# Altium schematic sheet MotorsController.SchDoc
size A3; SheetNumber: 4; SheetTotal: 6
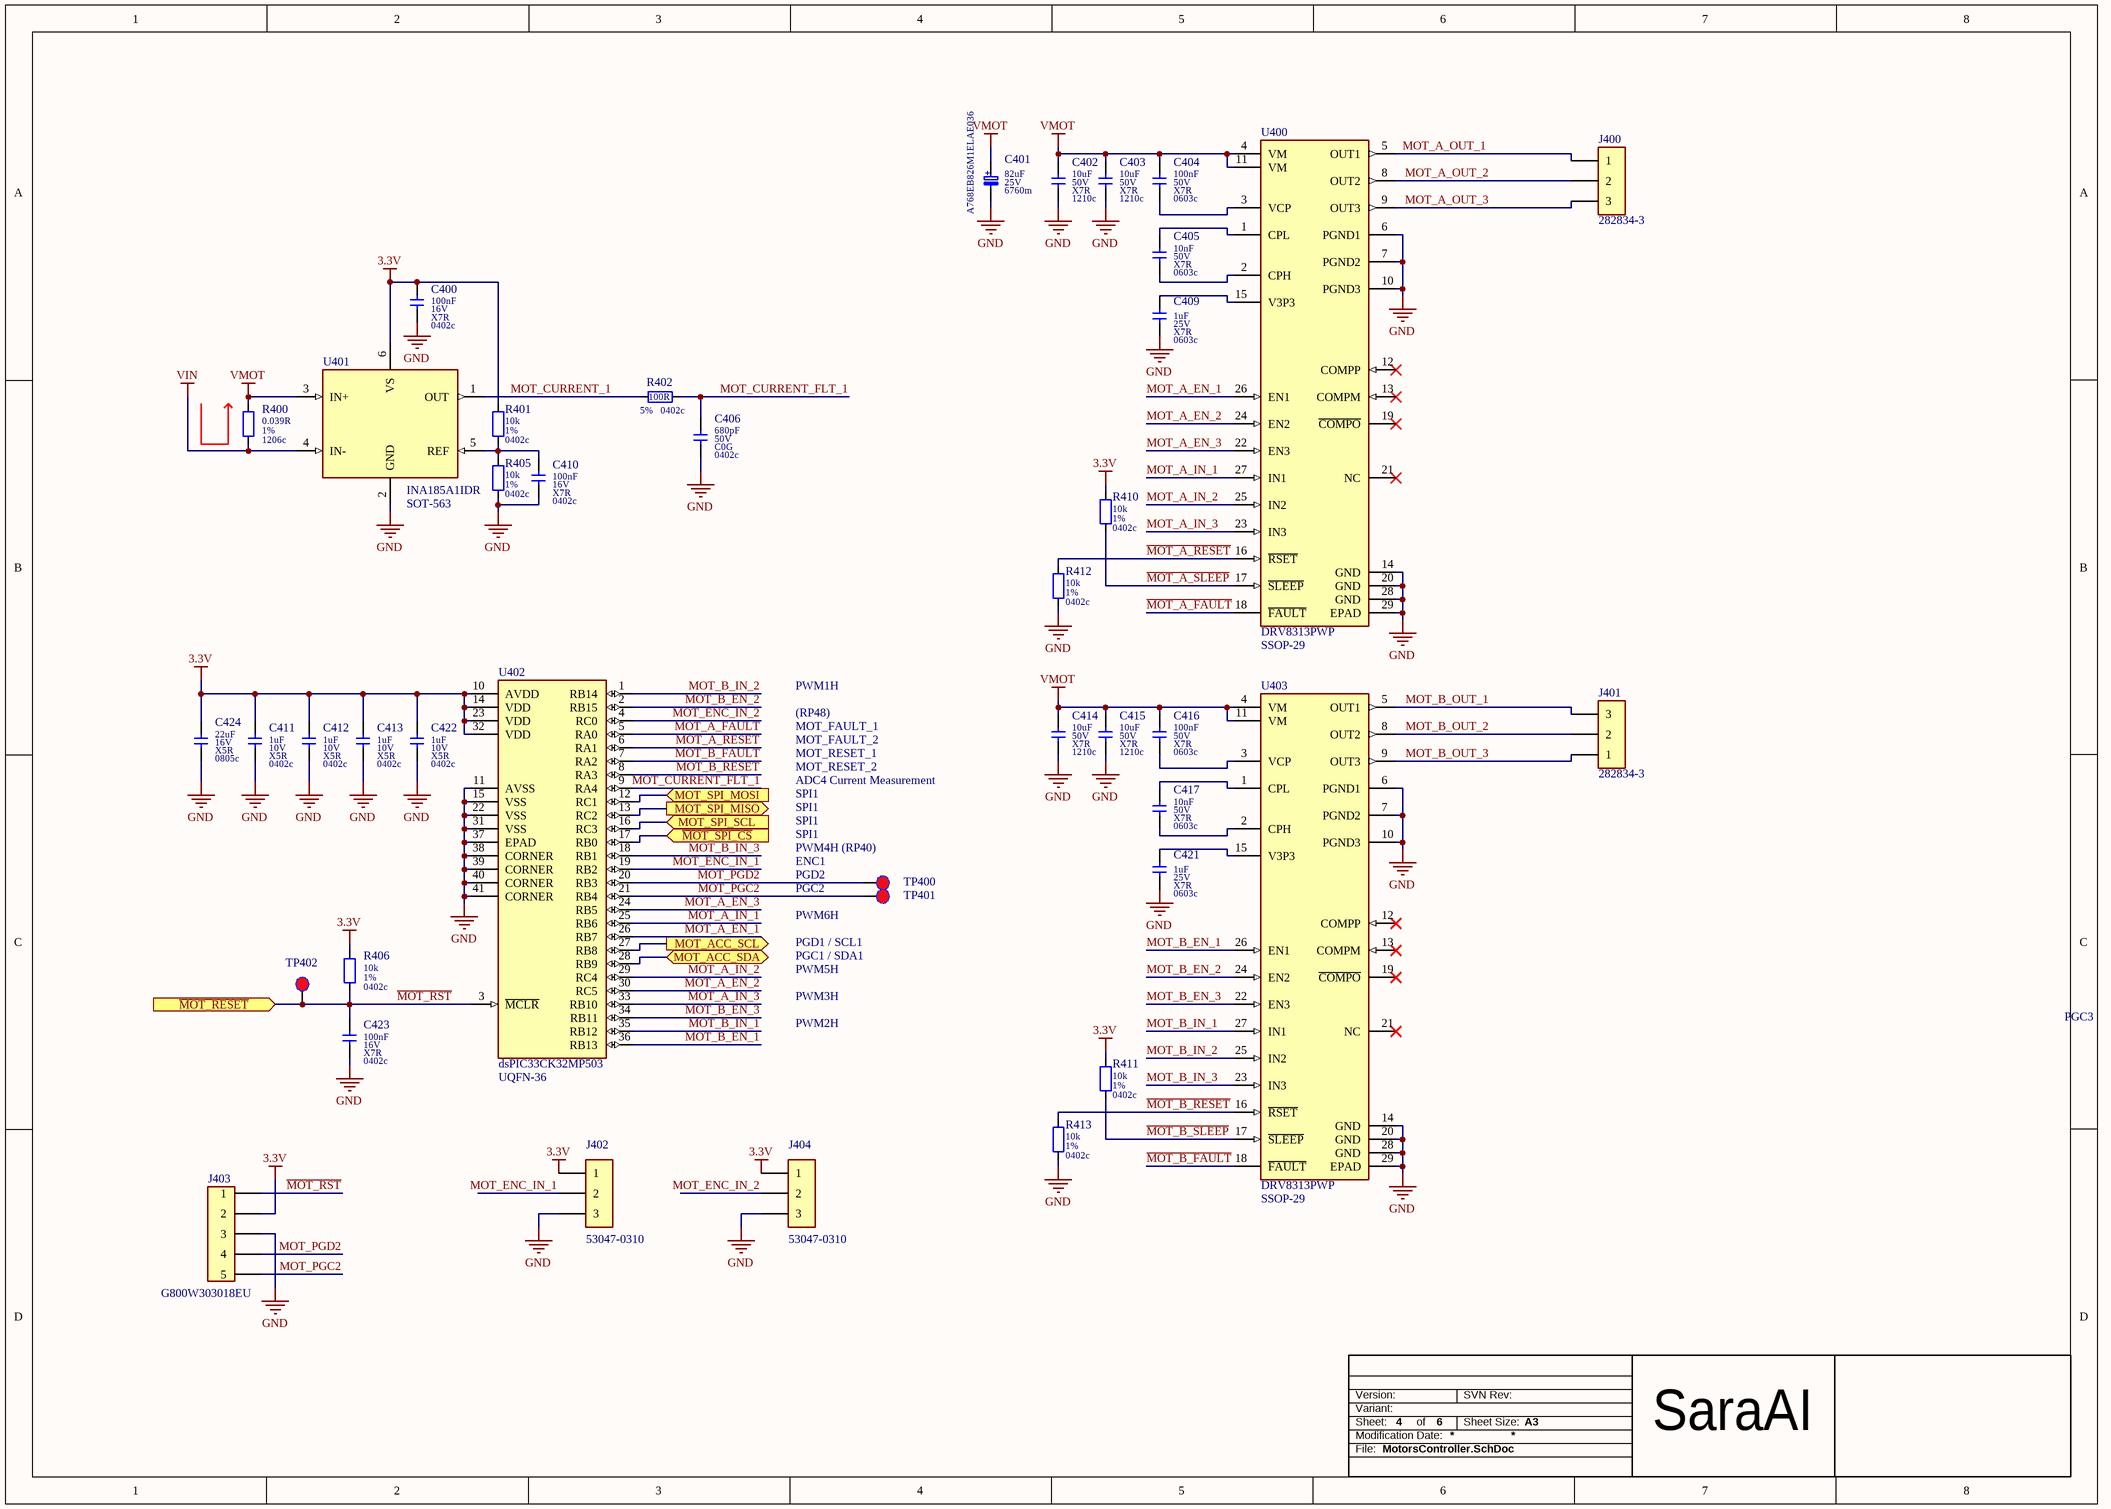
[diagram p0: MotorsController.SchDoc]

## Parts
C400  11 Parameter 4: X7R  07 Package: 0402c  08 Parameter 1: 100nF  09 Parameter 2: 16V  [CAPC1005X60L]  (hidden comment: CL05B104KO5NNNC)
C401  09 Parameter 2: 25V  08 Parameter 1: 82uF  07 Package: 6760m  [CAPAE660X60L]  (hidden comment: A768EB826M1ELAE036)
C402  11 Parameter 4: X7R  07 Package: 1210c  08 Parameter 1: 10uF  09 Parameter 2: 50V  [CAPC3225X270L]  (hidden comment: CL32B106KBJNNNE)
C403  11 Parameter 4: X7R  07 Package: 1210c  08 Parameter 1: 10uF  09 Parameter 2: 50V  [CAPC3225X270L]  (hidden comment: CL32B106KBJNNNE)
C404  11 Parameter 4: X7R  07 Package: 0603c  08 Parameter 1: 100nF  09 Parameter 2: 50V  [CAPC1608X90L]  (hidden comment: CL10B104KB8NNNC)
C405  11 Parameter 4: X7R  07 Package: 0603c  08 Parameter 1: 10nF  09 Parameter 2: 50V  [CAPC1608X90L]  (hidden comment: CL10B103KB8NNNC)
C406  11 Parameter 4: C0G  07 Package: 0402c  08 Parameter 1: 680pF  09 Parameter 2: 50V  [CAPC1005X60L]  (hidden comment: C0402C681J5GAC)
C409  11 Parameter 4: X7R  07 Package: 0603c  08 Parameter 1: 1uF  09 Parameter 2: 25V  [CAPC1608X90L]  (hidden comment: CL10B105KA8NNNC)
C410  11 Parameter 4: X7R  07 Package: 0402c  08 Parameter 1: 100nF  09 Parameter 2: 16V  [CAPC1005X60L]  (hidden comment: CL05B104KO5NNNC)
C411  11 Parameter 4: X5R  07 Package: 0402c  08 Parameter 1: 1uF  09 Parameter 2: 10V  [CAPC1005X60L]  (hidden comment: CL05A105KP5NNNC)
C412  11 Parameter 4: X5R  07 Package: 0402c  08 Parameter 1: 1uF  09 Parameter 2: 10V  [CAPC1005X60L]  (hidden comment: CL05A105KP5NNNC)
C413  11 Parameter 4: X5R  07 Package: 0402c  08 Parameter 1: 1uF  09 Parameter 2: 10V  [CAPC1005X60L]  (hidden comment: CL05A105KP5NNNC)
C414  11 Parameter 4: X7R  07 Package: 1210c  08 Parameter 1: 10uF  09 Parameter 2: 50V  [CAPC3225X270L]  (hidden comment: CL32B106KBJNNNE)
C415  11 Parameter 4: X7R  07 Package: 1210c  08 Parameter 1: 10uF  09 Parameter 2: 50V  [CAPC3225X270L]  (hidden comment: CL32B106KBJNNNE)
C416  11 Parameter 4: X7R  07 Package: 0603c  08 Parameter 1: 100nF  09 Parameter 2: 50V  [CAPC1608X90L]  (hidden comment: CL10B104KB8NNNC)
C417  11 Parameter 4: X7R  07 Package: 0603c  08 Parameter 1: 10nF  09 Parameter 2: 50V  [CAPC1608X90L]  (hidden comment: CL10B103KB8NNNC)
C421  11 Parameter 4: X7R  07 Package: 0603c  08 Parameter 1: 1uF  09 Parameter 2: 25V  [CAPC1608X90L]  (hidden comment: CL10B105KA8NNNC)
C422  11 Parameter 4: X5R  07 Package: 0402c  08 Parameter 1: 1uF  09 Parameter 2: 10V  [CAPC1005X60L]  (hidden comment: CL05A105KP5NNNC)
C423  11 Parameter 4: X7R  07 Package: 0402c  08 Parameter 1: 100nF  09 Parameter 2: 16V  [CAPC1005X60L]  (hidden comment: CL05B104KO5NNNC)
C424  11 Parameter 4: X5R  07 Package: 0805c  08 Parameter 1: 22uF  09 Parameter 2: 16V  [CAPC2013X145L]  (hidden comment: CL21A226MOQNNNE)
J400  282834-3  [TE 282834-3]
J401  282834-3  [TE 282834-3]
J402  53047-0310  [MOLEX 53047-0310]
J403  G800W303018EU  [Goldpin 2.54 1x5]
J404  53047-0310  [MOLEX 53047-0310]
R400  07 Package: 1206c  09 Parameter 2: 1%  08 Parameter 1: 0.039R  [RESC3216X65L]  (hidden comment: ERJ-8CWFR039V)
R401  07 Package: 0402c  09 Parameter 2: 1%  08 Parameter 1: 10k  [RESC1005X40L]  (hidden comment: RC0402FR-0710KL)
R402  07 Package: 0402c  09 Parameter 2: 5%  08 Parameter 1: 100R  [RESC1005X40L]  (hidden comment: 0402WGJ0101TCE)
R405  07 Package: 0402c  09 Parameter 2: 1%  08 Parameter 1: 10k  [RESC1005X40L]  (hidden comment: RC0402FR-0710KL)
R406  07 Package: 0402c  09 Parameter 2: 1%  08 Parameter 1: 10k  [RESC1005X40L]  (hidden comment: RC0402FR-0710KL)
R410  07 Package: 0402c  09 Parameter 2: 1%  08 Parameter 1: 10k  [RESC1005X40L]  (hidden comment: RC0402FR-0710KL)
R411  07 Package: 0402c  09 Parameter 2: 1%  08 Parameter 1: 10k  [RESC1005X40L]  (hidden comment: RC0402FR-0710KL)
R412  07 Package: 0402c  09 Parameter 2: 1%  08 Parameter 1: 10k  [RESC1005X40L]  (hidden comment: RC0402FR-0710KL)
R413  07 Package: 0402c  09 Parameter 2: 1%  08 Parameter 1: 10k  [RESC1005X40L]  (hidden comment: RC0402FR-0710KL)
TP400  TESTPAD  [TP 1.2mm]  (value not drawn)  (no BOM)
TP401  TESTPAD  [TP 1.2mm]  (value not drawn)  (no BOM)
TP402  TESTPAD  [TP 1.2mm]  (value not drawn)  (no BOM)
U400  07 Package: SSOP-29  [SOP65P640X110-HS52x31-29L]  (hidden comment: DRV8313PWP)
U401  07 Package: SOT-563  [SOT50P160X120X60_6L]  (hidden comment: INA185A1IDR)
U402  07 Package: UQFN-36  [QFN40P500X500X60-36_41L]  (hidden comment: dsPIC33CK32MP503)
U403  07 Package: SSOP-29  [SOP65P640X110-HS52x31-29L]  (hidden comment: DRV8313PWP)

## Ports
MOT_ACC_SCL (out), MOT_ACC_SDA (bidir), MOT_SPI_MISO (out), MOT_SPI_MOSI (in), MOT_SPI_SCL (in), ~{MOT_RESET} (in), ~{MOT_SPI_CS} (in)

## Nets
3.3V: C400.2 C411.2 C412.2 C413.2 C422.2 C424.2 J402.1 J403.2 J404.1 R401.2 R406.2 R410.2 R411.2 U401.6(VS) U402.10(AVDD) U402.14(VDD) U402.23(VDD) U402.32(VDD)
GND: C400.1 C401.2 C402.1 C403.1 C406.1 C409.1 C410.1 C411.1 C412.1 C413.1 C414.1 C415.1 C421.1 C422.1 C423.1 C424.1 J402.3 J403.3 J404.3 R405.1 R412.1 R413.1 U400.6(PGND1) U400.7(PGND2) U400.10(PGND3) U400.14(GND) U400.20(GND) U400.28(GND) U400.29(EPAD) U401.2(GND) U402.11(AVSS) U402.15(VSS) U402.22(VSS) U402.31(VSS) U402.37(EPAD) U402.38(CORNER) U402.39(CORNER) U402.40(CORNER) U402.41(CORNER) U403.6(PGND1) U403.7(PGND2) U403.10(PGND3) U403.14(GND) U403.20(GND) U403.28(GND) U403.29(EPAD)
VIN: R400.1 U401.4(IN-)
VMOT: C401.1 C402.2 C403.2 C404.2 C414.2 C415.2 C416.2 R400.2 U400.4(VM) U400.11(VM) U401.3(IN+) U403.4(VM) U403.11(VM)
~{MOT_A_FAULT}: U400.18(~{FAULT}) U402.5(RA0)
~{MOT_A_RESET}: R412.2 U400.16(~{RSET}) U402.6(RA1)
~{MOT_A_SLEEP}: R410.1 U400.17(~{SLEEP})
~{MOT_B_FAULT}: U402.7(RA2) U403.18(~{FAULT})
~{MOT_B_RESET}: R413.2 U402.8(RA3) U403.16(~{RSET})
~{MOT_B_SLEEP}: R411.1 U403.17(~{SLEEP})
~{MOT_RST}: C423.2 J403.1 R406.1 TP402.1 U402.3(~{MCLR}) ; port ~{MOT_RESET}
~{MOT_SPI_CS}: U402.17(RB0) ; port ~{MOT_SPI_CS}
MOT_A_EN_1: U400.26(EN1) U402.26(RB7)
MOT_A_EN_2: U400.24(EN2) U402.30(RC5)
MOT_A_EN_3: U400.22(EN3) U402.24(RB5)
MOT_A_IN_1: U400.27(IN1) U402.25(RB6)
MOT_A_IN_2: U400.25(IN2) U402.29(RC4)
MOT_A_IN_3: U400.23(IN3) U402.33(RB10)
MOT_A_OUT_1: J400.1 U400.5(OUT1)
MOT_A_OUT_2: J400.2 U400.8(OUT2)
MOT_A_OUT_3: J400.3 U400.9(OUT3)
MOT_ACC_SCL: U402.27(RB8) ; port MOT_ACC_SCL
MOT_ACC_SDA: U402.28(RB9) ; port MOT_ACC_SDA
MOT_B_EN_1: U402.36(RB13) U403.26(EN1)
MOT_B_EN_2: U402.2(RB15) U403.24(EN2)
MOT_B_EN_3: U402.34(RB11) U403.22(EN3)
MOT_B_IN_1: U402.35(RB12) U403.27(IN1)
MOT_B_IN_2: U402.1(RB14) U403.25(IN2)
MOT_B_IN_3: U402.18(RB1) U403.23(IN3)
MOT_B_OUT_1: J401.3 U403.5(OUT1)
MOT_B_OUT_2: J401.2 U403.8(OUT2)
MOT_B_OUT_3: J401.1 U403.9(OUT3)
MOT_CURRENT_1: R402.1 U401.1(OUT)
MOT_CURRENT_FLT_1: C406.2 R402.2 U402.9(RA4)
MOT_ENC_IN_1: J402.2 U402.19(RB2)
MOT_ENC_IN_2: J404.2 U402.4(RC0)
MOT_PGC2: J403.5 TP401.1 U402.21(RB4)
MOT_PGD2: J403.4 TP400.1 U402.20(RB3)
MOT_SPI_MISO: U402.13(RC2) ; port MOT_SPI_MISO
MOT_SPI_MOSI: U402.12(RC1) ; port MOT_SPI_MOSI
MOT_SPI_SCL: U402.16(RC3) ; port MOT_SPI_SCL
NetC404_1: C404.1 U400.3(VCP)
NetC405_1: C405.1 U400.2(CPH)
NetC405_2: C405.2 U400.1(CPL)
NetC409_2: C409.2 U400.15(V3P3)
NetC410_2: C410.2 R401.1 R405.2 U401.5(REF)
NetC416_1: C416.1 U403.3(VCP)
NetC417_1: C417.1 U403.2(CPH)
NetC417_2: C417.2 U403.1(CPL)
NetC421_2: C421.2 U403.15(V3P3)

Not connected (* = marked no-connect by the designer): U400 12(COMPP)* 13(COMPM)* 19(~{COMPO})* 21(NC)*; U403 12(COMPP)* 13(COMPM)* 19(~{COMPO})* 21(NC)*

## Notes on the sheet
- PWM1H
- (RP48)
- MOT_FAULT_1
- MOT_FAULT_2
- MOT_RESET_1
- MOT_RESET_2
- ADC4 Current Measurement
- PWM4H (RP40)
- SPI1
- PWM6H
- ENC1
- PGD2
- PGC2
- PWM5H
- PGD1 / SCL1
- PGC1 / SDA1
- PWM2H
- PWM3H
- PGC3
- Version:
- SVN Rev:
- Sheet:
- File:
- Modification Date:
- Variant:
- of
- Sheet Size:
- A3
- SaraAI
- (in symbol 498) +

## Library data of the parts
C400 C410 C423 = 138: SMT 0402c 100nF 16V 10% X7R 25.8MHz 125'C; 03 Manufacturer: Samsung; 00 Index: 138; 01 Name: CAPACITOR CERAMIC CL05B104KO5NNNC Samsung; 05 Sub Group: CERAMIC; 04 Main Group: CAPACITOR; 06 Assembly: SMT; 12 Parameter 5: 25.8MHz; 13 Parameter 6: 125'C; 14 Modification Date: 16.11.2020; ComponentLink1Description: DATASHEET; ComponentLink1URL: E:\Praca\Mindsailors\Mindsailors Altium\Database Library\Datasheets\CAPACITOR\Samsung CL05B104KO5NNNC.pdf; 02 MPN: CL05B104KO5NNNC; 10 Parameter 3: 10%
C401 = 498: SMT 6760m 82uF 25V 0,2 36mOhm 1.255A 125°; 03 Manufacturer: Kemet; 00 Index: 498; 01 Name: CAPACITOR POLYMER A768EB826M1ELAE036 Kemet; 04 Main Group: CAPACITOR; 05 Sub Group: POLYMER; 10 Parameter 3: 0,2; 16 Replacements: 25SVPK82M; Library Directory: sym_basics/; Fotprint Directory: fot_ipc/; 06 Assembly: SMT; 11 Parameter 4: 36mOhm; 12 Parameter 5: 1.255A; 13 Parameter 6: 125°; 14 Modification Date: 09.03.2021; ComponentLink1Description: DATASHEET; ComponentLink1URL: https://pl.mouser.com/datasheet/2/212/1/KEM_A4088_A768-1864506.pdf; 02 MPN: A768EB826M1ELAE036
C402 C403 C414 C415 = 259: SMT 1210c 10uF 50V 10% X7R 125°C; 03 Manufacturer: Samsung; 00 Index: 259; 01 Name: CAPACITOR CERAMIC CL32B106KBJNNNC Samsung; 05 Sub Group: CERAMIC; 04 Main Group: CAPACITOR; 06 Assembly: SMT; 13 Parameter 6: 125°C; 14 Modification Date: 25.01.2021; ComponentLink1Description: DATASHEET; ComponentLink1URL: http://weblib.samsungsem.com/mlcc/mlcc-ec-data-sheet.do?partNumber=CL32B106KBJNNN; 02 MPN: CL32B106KBJNNNE; 10 Parameter 3: 10%
C404 C416 = 164: SMT 0603c 100nF 50V 10% X7R 125'C; 03 Manufacturer: Samsung; 00 Index: 164; 01 Name: CAPACITOR CERAMIC CL10B104KB8NNNC Samsung; 05 Sub Group: CERAMIC; 04 Main Group: CAPACITOR; 06 Assembly: SMT; 13 Parameter 6: 125'C; 14 Modification Date: 21.12.2020; ComponentLink1Description: DATASHEET; ComponentLink1URL: E:\Praca\Mindsailors\Mindsailors Altium\Database Library\Datasheets\CAPACITOR\Samsung CL01B104KB8NNNC.pdf; 02 MPN: CL10B104KB8NNNC; 10 Parameter 3: 10%
C405 C417 = 192: SMT 0603c 10nF 50V 10% X7R 125°C; 03 Manufacturer: Samsung; 00 Index: 192; 01 Name: CAPACITOR CERAMIC CL10B103KB8NNNC Samsung; 05 Sub Group: CERAMIC; 04 Main Group: CAPACITOR; 06 Assembly: SMT; 13 Parameter 6: 125°C; 14 Modification Date: 25.01.2021; ComponentLink1Description: DATASHEET; ComponentLink1URL: http://weblib.samsungsem.com/mlcc/mlcc-ec-data-sheet.do?partNumber=CL10B103KB8NNN; 02 MPN: CL10B103KB8NNNC; 10 Parameter 3: 10%
C406 = 990: SMT 0402c 680pF 50V 0,05 C0G 229MHz 125'C; 03 Manufacturer: Kemet; 00 Index: 990; 01 Name: CAPACITOR CERAMIC C0402C681J5GAC Kemet; 05 Sub Group: CERAMIC; 10 Parameter 3: 5%; Library Directory: sym_basics/; Fotprint Directory: fot_ipc/; 04 Main Group: CAPACITOR; 06 Assembly: SMT; 12 Parameter 5: 229MHz; 13 Parameter 6: 125'C; 14 Modification Date: 16.03.2022; ComponentLink1Description: DATASHEET; ComponentLink1URL: https://www.kemet.com/en/us/capacitors/ceramic/kc-link/product/C0402C681J5GAC%7BBULK%7D.html; 02 MPN: C0402C681J5GAC
C409 C421 = 193: SMT 0603c 1uF 25V 10% X7R 125°C; 03 Manufacturer: Samsung; 00 Index: 193; 01 Name: CAPACITOR CERAMIC CL10B105KA8NNNC Samsung; 05 Sub Group: CERAMIC; 04 Main Group: CAPACITOR; 06 Assembly: SMT; 13 Parameter 6: 125°C; 14 Modification Date: 25.01.2021; ComponentLink1Description: DATASHEET; ComponentLink1URL: http://weblib.samsungsem.com/mlcc/mlcc-ec-data-sheet.do?partNumber=CL10B105KA8NNN; 02 MPN: CL10B105KA8NNNC; 10 Parameter 3: 10%
C411-C413 C422 = 154: SMT 0402c 1uF 10V 10% X5R 10.2MHz 85'C; 03 Manufacturer: Samsung; 00 Index: 154; 01 Name: CAPACITOR THICK FILM CL05A105KP5NNNC Samsung; 05 Sub Group: THICK FILM; 04 Main Group: CAPACITOR; 06 Assembly: SMT; 12 Parameter 5: 10.2MHz; 13 Parameter 6: 85'C; 14 Modification Date: 16.11.2020; ComponentLink1Description: DATASHEET; ComponentLink1URL: E:\Praca\Mindsailors\Mindsailors Altium\Database Library\Datasheets\CAPACITOR\Samsung CL05A105KP5NNNC.pdf; 02 MPN: CL05A105KP5NNNC; 10 Parameter 3: 10%
C424 = 81: SMT 0805c 22uF 16V 20% X5R 1.6MHz 85'C; 03 Manufacturer: Samsung; 00 Index: 81; 01 Name: CAPACITOR CERAMIC CL21A226MOQNNNE Samsung; 05 Sub Group: CERAMIC; 04 Main Group: CAPACITOR; 06 Assembly: SMT; 12 Parameter 5: 1.6MHz; 13 Parameter 6: 85'C; 14 Modification Date: 16.11.2020; ComponentLink1Description: DATASHEET; ComponentLink1URL: E:\Praca\Mindsailors\Mindsailors Altium\Database Library\Datasheets\CAPACITOR\Samsung CL21A226MOQNNN.pdf; 02 MPN: CL21A226MOQNNNE; 10 Parameter 3: 20%
J400 J401 = 979: THT 1x3 2.54mm Straight 150V 10A; 03 Manufacturer: TE Connectivity; 00 Index: 979; 01 Name: CONNECTOR WIRE 282834-3 TE Connectivity; 04 Main Group: CONNECTOR; 05 Sub Group: WIRE; Library Directory: sym_basics/; Fotprint Directory: fot_other/; 06 Assembly: THT; 13 Parameter 6: 10A; 14 Modification Date: 04.01.2022; ComponentLink1Description: DATASHEET; ComponentLink1URL: https://www.te.com/usa-en/product-282834-2.html; 09 Parameter 2: 2.54mm; 08 Parameter 1: 1x3; 11 Parameter 4: Straight; 12 Parameter 5: 150V; 02 MPN: 282834-3; 07 Package: *
J402 J404 = 991: THT 1x3 1.25mm Straight 125V 1A; 03 Manufacturer: Molex; 00 Index: 991; 01 Name: CONNECTOR WIRE 53047-0310 Molex; 04 Main Group: CONNECTOR; 05 Sub Group: WIRE; Library Directory: sym_basics/; Fotprint Directory: fot_other/; 06 Assembly: THT; 13 Parameter 6: 1A; 14 Modification Date: 28.03.2022; ComponentLink1Description: DATASHEET; ComponentLink1URL: https://www.tme.eu/Document/f8f78d18d800f08aedb247ee6832d80d/mx53047.pdf; 09 Parameter 2: 1.25mm; 08 Parameter 1: 1x3; 11 Parameter 4: Straight; 12 Parameter 5: 125V; 02 MPN: 53047-0310; 07 Package: *
J403 = 982: THT 1X5 2.54mm Straight 110V 3A; 03 Manufacturer: Amphenol; 00 Index: 982; 01 Name: CONNECTOR WIRE G800W303018EU Amphenol; 04 Main Group: CONNECTOR; 05 Sub Group: WIRE; Library Directory: sym_basics/; Fotprint Directory: fot_other/; 06 Assembly: THT; 13 Parameter 6: 3A; 14 Modification Date: 10.01.2022; ComponentLink1Description: DATASHEET; ComponentLink1URL: https://www.mouser.pl/ProductDetail/Amphenol-Commercial-Products/G800W303018EU?qs=f9yNj16SXrJ5tCX5FPao9w%3D%3D; 09 Parameter 2: 2.54mm; 08 Parameter 1: 1X5; 11 Parameter 4: Straight; 12 Parameter 5: 110V; 07 Package: *; 02 MPN: G800W303018EU
R400 = 507: SMT 1206c 0.039R 1% 1W 50ppm/K; 03 Manufacturer: Panasonic; 00 Index: 507; 01 Name: RESISTOR THICK FILM ERJ-8CWFR039V Panasonic; 05 Sub Group: THICK FILM; 04 Main Group: RESISTOR; 06 Assembly: SMT; 11 Parameter 4: 50ppm/K; 14 Modification Date: 15.03.2021; ComponentLink1Description: DATASHEET; ComponentLink1URL: https://datasheet.octopart.com/ERJ-8CWFR039V-Panasonic-datasheet-28468620.pdf; 10 Parameter 3: 1W; 02 MPN: ERJ-8CWFR039V
R401 R405 R406 R410-R413 = 15: SMT 0402c 10k 1% 62.5mW 100ppm/K 50V; 03 Manufacturer: Yageo; 00 Index: 15; 01 Name: RESISTOR THICK FILM RC0402FR-0710KL Yageo; 05 Sub Group: THICK FILM; 04 Main Group: RESISTOR; 06 Assembly: SMT; 11 Parameter 4: 100ppm/K; 12 Parameter 5: 50V; 14 Modification Date: 16.11.2020; ComponentLink1Description: DATASHEET; ComponentLink1URL: E:\Praca\Mindsailors\Mindsailors Altium\Database Library\Datasheets\RESISTOR\Yageo RC_L Series.pdf; 10 Parameter 3: 62.5mW; 02 MPN: RC0402FR-0710KL
R402 = 129: SMT 0402c 100R 5% 62.5mW 200ppm/K 50V; 03 Manufacturer: Royal Ohm; 00 Index: 129; 01 Name: RESISTOR THICK FILM 0402WGJ0101TCE Royal Ohm; 05 Sub Group: THICK FILM; Library Directory: sym_basics/; Fotprint Directory: fot_ipc/; 04 Main Group: RESISTOR; 06 Assembly: SMT; 11 Parameter 4: 200ppm/K; 12 Parameter 5: 50V; 14 Modification Date: 16.11.2020; ComponentLink1Description: DATASHEET; ComponentLink1URL: E:\Praca\Mindsailors\Mindsailors Altium\Database Library\Datasheets\RESISTOR\ROYAL OHM Thick Film Chip Resistors.pdf; 10 Parameter 3: 62.5mW; 02 MPN: 0402WGJ0101TCE
TP400-TP402 = 10: 00 Index: 10; 01 Name: PCB COMPONENT TESTPAD TESTPAD; 04 Main Group: PCB COMPONENT; 02 MPN: TESTPAD; 05 Sub Group: TESTPAD; 14 Modification Date: 16.11.2020
U400 U403 = 989: SMT SSOP-29 Motor 60V 2.5A; 03 Manufacturer: Texas Instruments; 00 Index: 989; 01 Name: IC DRIVER DRV8313PWP Texas Instruments; 04 Main Group: IC; 05 Sub Group: DRIVER; Library Directory: sym_other/; Fotprint Directory: fot_ipc/; 06 Assembly: SMT; 11 Parameter 4: 60V; 12 Parameter 5: 2.5A; 14 Modification Date: 16.03.2022; ComponentLink1Description: DATASHEET; ComponentLink1URL: https://www.ti.com/lit/ds/symlink/drv8313.pdf?ts=1612516575666&ref_url=https%253A%252F%252Fwww.ti.com%252Fmotor-drivers%252Fbrushless-dc-bldc-drivers%252Fproducts.html%253Fpqs%253Dpaqs%2526familyid%253D2009; 08 Parameter 1: Motor; 02 MPN: DRV8313PWP
U401 = 506: SMT SOT-563 1 350kHz 2V/us; 03 Manufacturer: Texas Instruments; 00 Index: 506; 01 Name: IC AMPLIFIER INA185A1IDR Texas Instruments; 04 Main Group: IC; 05 Sub Group: AMPLIFIER; 11 Parameter 4: 1; 06 Assembly: SMT; 12 Parameter 5: 350kHz; 13 Parameter 6: 2V/us; 14 Modification Date: 15.03.2021; ComponentLink1Description: DATASHEET; ComponentLink1URL: https://www.ti.com/lit/ds/sbos378/sbos378.pdf?ts=1615805217899&ref_url=https%253A%252F%252Fwww.google.com%252F; 02 MPN: INA185A1IDR
U402 = 510: SMT UQFN-36 3-3.6V 100MHz 32kB; 03 Manufacturer: Microchip; 00 Index: 510; 01 Name: IC MICROCONTROLLER dsPIC33CK32MP503 Microchip; 04 Main Group: IC; 05 Sub Group: MICROCONTROLLER; 06 Assembly: SMT; 11 Parameter 4: 3-3.6V; 12 Parameter 5: 100MHz; 13 Parameter 6: 32kB; 14 Modification Date: 22.03.2021; ComponentLink1Description: DATASHEET; ComponentLink1URL: https://ww1.microchip.com/downloads/en/DeviceDoc/dsPIC33CK256MP508-Family-Data-Sheet-DS70005349H.pdf; 02 MPN: dsPIC33CK32MP503